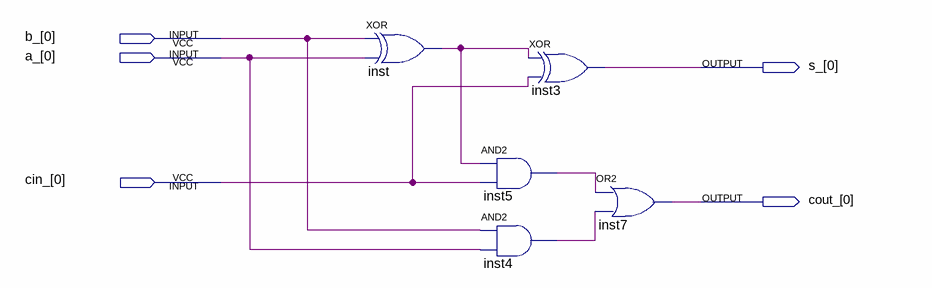
[diagram p0: schematic sheet]
// Quartus schematic 1bit-fulladder.bdf as structural Verilog: 5 symbols, 5 pins
module \1bit-fulladder  (
  input  [0:0] b_,
  input  [0:0] a_,
  input  [0:0] cin_,
  output [0:0] s_,
  output [0:0] cout_
);

  wire inst4_out, inst5_out, inst_out;

  xor inst (inst_out, b_[0], a_[0]);
  and inst5 (inst5_out, inst_out, cin_[0]);
  and inst4 (inst4_out, b_[0], a_[0]);
  xor inst3 (s_[0], inst_out, cin_[0]);
  or inst7 (cout_[0], inst5_out, inst4_out);
endmodule
